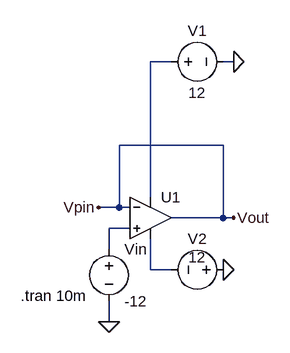
[diagram p0: schematic voltage-follower.asc]
voltage-follower.asc, the LTspice schematic file:
Version 4
SHEET 1 880 680
WIRE 240 -80 208 -80
WIRE 336 -80 320 -80
WIRE 320 48 160 48
WIRE 208 128 208 -80
WIRE 160 144 160 48
WIRE 160 144 128 144
WIRE 176 144 160 144
WIRE 320 160 320 48
WIRE 320 160 240 160
WIRE 336 160 320 160
WIRE 176 176 144 176
WIRE 144 208 144 176
WIRE 208 240 208 192
WIRE 240 240 208 240
WIRE 144 320 144 288
FLAG 320 240 0
FLAG 336 -80 0
FLAG 336 160 Vout
FLAG 144 320 0
FLAG 128 144 Vpin
SYMBOL voltage 336 240 R90
WINDOW 0 -32 56 VBottom 2
WINDOW 3 -4 56 VBottom 2
WINDOW 123 0 0 Left 0
WINDOW 39 0 0 Left 0
SYMATTR InstName V2
SYMATTR Value 12
SYMBOL OpAmps\\UniversalOpamp 208 160 R0
SYMATTR InstName U1
SYMBOL voltage 224 -80 R270
WINDOW 0 32 56 VTop 2
WINDOW 3 -32 56 VBottom 2
WINDOW 123 0 0 Left 0
WINDOW 39 0 0 Left 0
SYMATTR InstName V1
SYMATTR Value 12
SYMBOL voltage 144 192 R0
WINDOW 123 0 0 Left 0
WINDOW 39 0 0 Left 0
SYMATTR InstName Vin
SYMATTR Value -12
TEXT 8 280 Left 2 !.tran 10m

The netlist it stands for:
* voltage-follower.asc
V2 0 N003 12
XU1 N002 Vpin N001 N003 Vpin level1 Avol=1Meg GBW=10Meg Vos=0 En=0 Enk=0 In=0 Ink=0 Rin=500Meg  ; pins In+ In- V+ V- OUT
V1 N001 0 12
Vin N002 0 -12
.tran 10m
.lib UniversalOpAmp1.lib
.backanno
.end